# EasyEDA Pro project xiaozhi_pcb_v1.eprj

# Schematic Schematic1
Board Name: Watch; Create Date: 2025-01-26; Page Name: P1; Project Name: xiaozhi_pcb_v1; Schematic Name: Schematic1; Update Date: 2025-04-02; Company: myry; Drawed: myry; Page Size: A3; Reviewed: myry; Version: V1.0
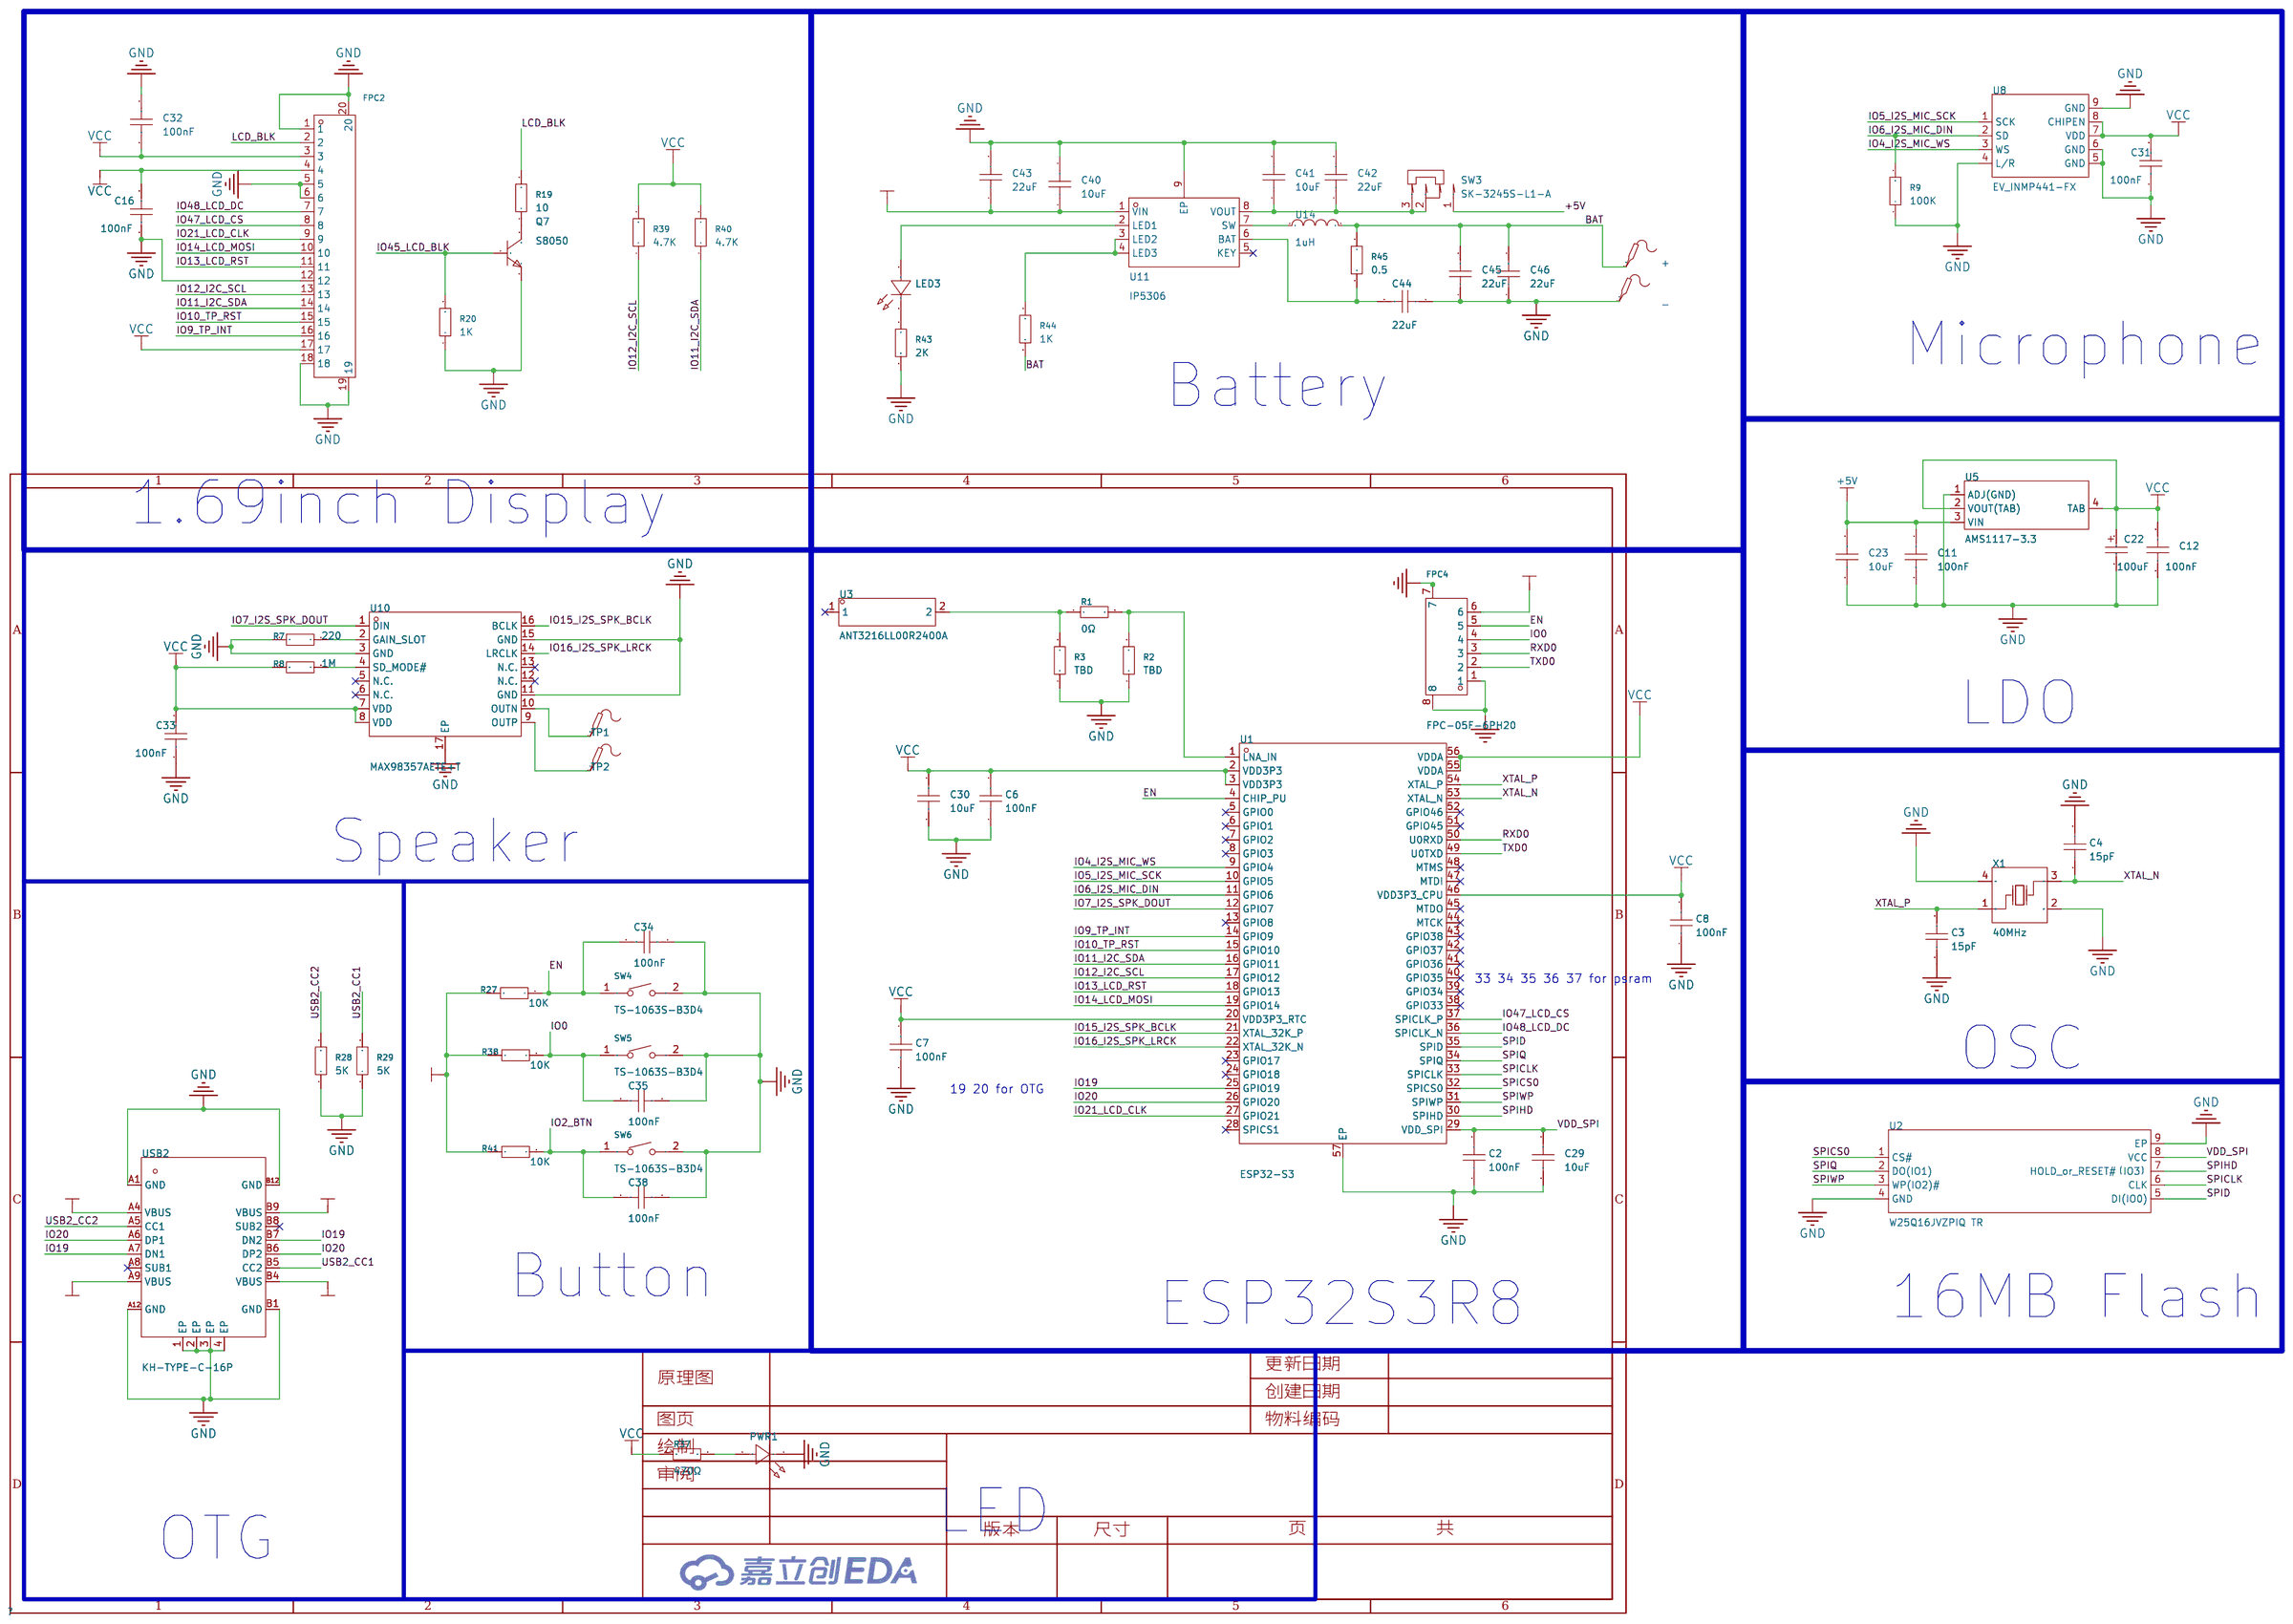
[diagram p0: schematic sheet]

## Parts
+  -  [Test-Point-0.5mm]
-  -  [Test-Point-0.5mm]
C2  100nF  [C0402]
C3  15pF  [C0402]
C4  15pF  [C0402]
C6  100nF  [C0402]
C7  100nF  [C0402]
C8  100nF  [C0402]
C11  100nF  [C0402]
C12  100nF  [C0402]
C16  100nF  [C0402]
C22  100uF  [CASE-B_3528]
C23  10uF  [C0603]
C29  10uF  [C0603]
C30  10uF  [C0603]
C31  100nF  [C0402]
C32  100nF  [C0402]
C33  100nF  [C0402]
C34  100nF  [C0402]
C35  100nF  [C0402]
C38  100nF  [C0402]
C40  10uF  [C0603]
C41  10uF  [C0603]
C42  22uF  [C0603]
C43  22uF  [C0603]
C44  22uF  [C0603]
C45  22uF  [C0603]
C46  22uF  [C0603]
FPC2  FPC-05F-18PH20  [FPC-SMD_18P-P0.50_FPC-05F-18PH20]
FPC4  FPC-05F-6PH20  [FPC-SMD_6P-P0.50_XUNPU_FPC-05F-6PH20]
LED3  XL-1608SURC-06  [LED0603-RD_RED]
PWR1  XL-1608SURC-06  [LED0603-RD_RED]
Q7  S8050  [SOT-23-3_L2.9-W1.3-P1.90-LS2.3-BR]
R1  0Ω  [R0402]
R2  TBD  [R0402]
R3  TBD  [R0402]
R7  220  [R0402]
R8  1M  [R0402]
R9  100K  [R0402]
R19  10  [R0402]
R20  1K  [R0402]
R27  10K  [R0402]
R28  5K  [R0402]
R29  5K  [R0402]
R37  470Ω  [R0402]
R38  10K  [R0402]
R39  4.7K  [R0402]
R40  4.7K  [R0402]
R41  10K  [R0402]
R43  2K  [R0402]
R44  1K  [R0402]
R45  0.5  [R0402]
SW3  SK-3245S-L1-A  [SW-SMD_SK-3245S-L1-A-1]
SW4  TS-1063S-B3D4  [KEY-SMD_L3.0-W2.5-LS4.0_TS-1603S]
SW5  TS-1063S-B3D4  [KEY-SMD_L3.0-W2.5-LS4.0_TS-1603S]
SW6  TS-1063S-B3D4  [KEY-SMD_L3.0-W2.5-LS4.0_TS-1603S]
TP1  -  [Test-Point-0.5mm]
TP2  -  [Test-Point-0.5mm]
U1  ESP32-S3  [QFN-56_L7.0-W7.0-P0.40-TL-EP4.0]
U2  W25Q16JVZPIQ TR  [WSON-8_L6.0-W5.0-P1.27-BL-EP]
U3  ANT3216LL00R2400A  [ANT-SMD_L3.2-W1.6]
U5  AMS1117-3.3  [SOT-223-4_L6.5-W3.5-P2.30-LS7.0-BR]
U8  EV_INMP441-FX  [MID-SMD_L4.7-W3.8_INMP441ACEZ]
U10  MAX98357AETE+T  [TQFN-16_L3.0-W3.0-P0.50-BL-EP1.5]
U11  IP5306  [ESOP-8_L4.9-W3.9-P1.27-LS6.0-BL-EP]
U14  1uH  [IND-SMD_L2.5-W2.0_YXNAQ252010-3R3M]
USB2  KH-TYPE-C-16P  [USB-C-SMD_KH-TYPE-C-16P]
X1  40MHz  [OSC-SMD_4P-L3.2-W2.5-BL_SIT8008BI]

## Library data of the parts
+ - TP1 TP2 = Test-Point: Test Point 测试点
C2-C4 C6-C8 = CL05A105KA5NQNC: Capacitance: Tolerance:±10% Tolerance:±10% Voltage Rated: Temperature Coefficient:; LCSC Part Name: 1uF ±10% 25V; Supplier Part: C52923; Manufacturer: SAMSUNG(三星); Supplier Footprint: 0402; JLCPCB Part Class: Basic Part; Datasheet: https://atta.szlcsc.com/upload/public/pdf/source/20160218/1457707763339.pdf; Supplier: LCSC; Tolerance: ±10%
C11 C12 C16 C31-C35 C38 = CL05B104KO5NNNC: Capacitance: Tolerance:±10% Tolerance:±10% Voltage Rated: Temperature Coefficient:; LCSC Part Name: 100nF ±10% 16V; Supplier Part: C1525; Manufacturer: SAMSUNG(三星); Supplier Footprint: 0402; JLCPCB Part Class: Basic Part; Datasheet: https://atta.szlcsc.com/upload/public/pdf/source/20160218/1457707763339.pdf; Supplier: LCSC; Tolerance: ±10%
C22 = TAJB107K006RNJ: Capacitance: Tolerance:±10% Tolerance:±10% Rated Voltage: Equivalent Series Resistance(ESR):1.7Ω@100kHz Operating Temperature:-55℃~+125℃ Operating Temperature:-55℃~+125℃; LCSC Part Name: 100uF ±10% 6.3V; Supplier Part: C16133; Manufacturer: Kyocera AVX; Supplier Footprint: CASE-B-3528-21(mm); JLCPCB Part Class: Basic Part; Datasheet: https://atta.szlcsc.com/upload/public/pdf/source/20160107/1457707750344.pdf; Supplier: LCSC; Tolerance: ±10%; Equivalent Series Resistance(ESR): 1.7Ω@100kHz; Operating Temperature: -55℃~+125℃
C23 C29 C30 C40-C46 = CGA0603X5R106K100JT: Capacitance:10uF Tolerance:±10% Tolerance:±10% Voltage Rating:10V Temperature Coefficient:X5R; LCSC Part Name: 10uF ±10% 10V; Supplier Part: C6119842; Manufacturer: HRE(芯声); Supplier Footprint: 0603; JLCPCB Part Class: Extended Part; Supplier: LCSC; Tolerance: ±10%; Voltage Rating: 10V; Temperature Coefficient: X5R
FPC2 = FPC-05F-18PH20: Locking Feature:Clamshell Contact Type:Bottom Contact Number of Contacts:18P Pitch:0.5mm Mounting Type:卧贴 FFC, FCB Thickness:0.3mm FFC, FCB Thickness:0.3mm Height Above Board:2mm Operating Temperature Range:-25℃~+85℃ Operating Temperature Range:-25℃~+85℃; LCSC Part Name: 间距:0.5mm P数:18P 翻盖式 下接; Supplier Part: C2856802; Manufacturer: XUNPU(讯普); Supplier Footprint: SMD,P=0.5mm,卧贴; JLCPCB Part Class: Extended Part; Datasheet: https://atta.szlcsc.com/upload/public/pdf/source/20210922/C2856802_2A845D1961F33AEC1ED22CECB292335F.pdf; Supplier: LCSC; Locking Feature: Clamshell; Contact Type: Bottom Contact; Number of Contacts: 18P; Pitch: 0.5mm; Mounting Type: 卧贴; FFC, FCB Thickness: 0.3mm; Height Above Board: 2mm; Operating Temperature Range: -25℃~+85℃
FPC4 = FPC-05F-6PH20: LCSC Part Name: 间距:0.5mm P数:6P 翻盖式 下接; Supplier Part: C2856796; Manufacturer: XUNPU(讯普); Supplier Footprint: SMD,P=0.5mm,卧贴; JLCPCB Part Class: Extended Part; Datasheet: https://atta.szlcsc.com/upload/public/pdf/source/20210922/16B003FB53336DDF6538142CC465AC4D.pdf; Supplier: LCSC; Locking Feature: Clamshell; Contact Type: Bottom Contact; Number of Contacts: 6P; Pitch: 0.5mm; Mounting Type: 卧贴; FFC, FCB Thickness: 0.3mm; Height Above Board: 2mm; Operating Temperature Range: -25℃~+85℃
LED3 PWR1 = XL-1608SURC-06: Emitted Color:Red Power Dissipation:55mW Forward Current:25mA Dominant Wavelength:617nm~621nm Dominant Wavelength:617nm~621nm Peak Wavelength:623nm Lens Color:无色透明透镜 Color Temperature:- Color Temperature:- Viewing Angle:120° Mounting Sytle:Positive post O; Supplier Part: C965799; Manufacturer: XINGLIGHT(成兴光); Supplier Footprint: 0603; JLCPCB Part Class: Extended Part; Datasheet: https://atta.szlcsc.com/upload/public/pdf/source/20221102/D860AFDD1CDB02C5A8064103A32707E2.pdf; Supplier: LCSC; Emitted Color: Red; Power Dissipation: 55mW; Forward Current: 25mA; Dominant Wavelength: 617nm~621nm; Peak Wavelength: 623nm; Lens Color: 无色透明透镜; Viewing Angle: 120°; Mounting Sytle: Positive post; Operating Temperature: -30℃~+85℃; Illumination Color: Red; Voltage - Forward(Vf): 2.3V; Power(Watts): 50mW; Wavelength - Dominant: 620nm~630nm; Luminous Intensity: 225mcd
Q7 = S8050_C20069125: type:NPN Current - Collector(Ic): Collector - Emitter Voltage VCEO: Pd - Power Dissipation:300mW DC Current Gain:120@50mA,1.0V DC Current Gain:120@50mA,1.0V Transition frequency(fT):100MHz Current - Collector Cutoff:100nA Vce Saturation(VCE(sat)):600mV Op; LCSC Part Name: hFE:200-350，丝印:J3Y S8050; Supplier Part: C20069125; Manufacturer: 宏嘉诚; Supplier Footprint: SOT-23; JLCPCB Part Class: Extended Part; Datasheet: https://atta.szlcsc.com/upload/public/pdf/source/20250107/343E8B94B5C24D0D65D7D4B70E0B73F6.pdf; Supplier: LCSC; type: NPN; Pd - Power Dissipation: 300mW; DC Current Gain: 120@50mA,1.0V; Transition frequency(fT): 100MHz; Current - Collector Cutoff: 100nA; Vce Saturation(VCE(sat)): 600mV; Operating Temperature: -55℃~+150℃
R1-R3 = 0402WGF0000TCE: Type:Thick Film Resistors Resistance: Tolerance:±1% Tolerance:±1% Power(Watts): Overload Voltage (Max): Temperature Coefficient:±800ppm/℃ Temperature Coefficient:±800ppm/℃ Operating Temperature Range:-55℃~+155℃ Operating Temperature Range:-55℃~+155℃; LCSC Part Name: 0Ω ±1% 62.5mW 厚膜电阻; Supplier Part: C17168; Manufacturer: UNI-ROYAL(厚声); Supplier Footprint: 0402; JLCPCB Part Class: Basic Part; Datasheet: https://atta.szlcsc.com/upload/public/pdf/source/20200306/C422600_1E6D84923E4A46A82E41ADD87F860B5C.pdf; Supplier: LCSC; Type: Thick Film Resistors; Tolerance: ±1%; Temperature Coefficient: ±800ppm/℃; Operating Temperature Range: -55℃~+155℃
R7-R9 R19 R20 R27-R29 R37-R41 R43-R45 = 0402WGF4700TCE: Type:Thick Film Resistors Resistance: Tolerance:±1% Tolerance:±1% Power(Watts): Overload Voltage (Max): Temperature Coefficient:±100ppm/℃ Temperature Coefficient:±100ppm/℃ Operating Temperature Range:-55℃~+155℃ Operating Temperature Range:-55℃~+155℃; LCSC Part Name: 470Ω ±1% 62.5mW 厚膜电阻; Supplier Part: C25117; Manufacturer: UNI-ROYAL(厚声); Supplier Footprint: 0402; JLCPCB Part Class: Basic Part; Datasheet: https://atta.szlcsc.com/upload/public/pdf/source/20200306/C422600_1E6D84923E4A46A82E41ADD87F860B5C.pdf; Supplier: LCSC; Type: Thick Film Resistors; Tolerance: ±1%; Temperature Coefficient: ±100ppm/℃; Operating Temperature Range: -55℃~+155℃
SW3 = SK-3245S-L1-A: Circuit:DPDT Actuator Style:Rectangular columnar Pin Style:SMDSplicing Switch Length:9.1mm Switch Width:3.55mm Switch Height:3.2mm Mounting Style:卧贴 Actuator Color:Black Current Rating (DC):50mA Voltage Rating (DC):12V Current Rating (AC):50mA Voltage Rat; LCSC Part Name: 柄长2mm 卧贴双档 滑动开关; Supplier Part: C405951; Manufacturer: XKB Connection(中国星坤); Supplier Footprint: SMD; JLCPCB Part Class: Extended Part; Datasheet: https://atta.szlcsc.com/upload/public/pdf/source/20200227/C405951_CBAB505F81ACCB08512C6DA919ADD92C.pdf; Supplier: LCSC; Circuit: DPDT; Actuator Style: Rectangular columnar; Pin Style: SMDSplicing; Switch Length: 9.1mm; Switch Width: 3.55mm; Switch Height: 3.2mm; Mounting Style: 卧贴; Actuator Color: Black; Current Rating (DC): 50mA; Voltage Rating (DC): 12V; Current Rating (AC): 50mA; Voltage Rating (AC): 12V; Mechanical Life: 1万次; Operating Temperature: -40℃~+85℃
SW4-SW6 = TS-1063S-B3D4: Circuit:SPST Actuator Style:Rectangle button Operating Force:250gf Mounting Style:- With Lamp:- Mechanical Life:-; LCSC Part Name: 轻触开关3.0*2.5侧按贴片带柱小小龟250gf; Supplier Part: C498291; Manufacturer: Yuandi(元迪); JLCPCB Part Class: Extended Part; Datasheet: https://atta.szlcsc.com/upload/public/pdf/source/20200318/C498291_A3607BD92317BA61A63F6AFAF35A0DD0.pdf; Supplier: LCSC; Circuit: SPST; Actuator Style: Rectangle button; Operating Force: 250gf
U1 = ESP32-S3: Frequency Range:2412MHz~2484MHz Frequency Range:2412MHz~2484MHz Interface:ADC,GPIO,I2C,I2S,PWM,SPI,UART,USB Operating Voltage:3V~3.6V Operating Voltage:3V~3.6V Applications:WiFi；IoT Output Power:21dBm Data Rate:150Mbps Current Of Transmitting:340mA Sensit; LCSC Part Name: 支持2.4GHz WIFI和低功耗蓝牙的MCU SoC; Supplier Part: C2913192; Manufacturer: ESPRESSIF(乐鑫); Supplier Footprint: QFN-56-EP(7x7); JLCPCB Part Class: Extended Part; Datasheet: https://atta.szlcsc.com/upload/public/pdf/source/20241030/3428D9BCA56E860957850BFAF37EAC62.pdf; Supplier: LCSC; Frequency Range: 2412MHz~2484MHz; Interface: ADC,GPIO,I2C,I2S,PWM,SPI,UART,USB; Operating Voltage: 3V~3.6V; Applications: WiFi；IoT; Output Power: 21dBm; Data Rate: 150Mbps; Current Of Transmitting: 340mA; Sensitivity: -98.4dBm; Receive Current: 88mA; Typical Application Frequency: 2.4GHz; Operating Temperature: -40℃~+105℃
U2 = W25Q16JVZPIQ TR: Supplier Part: C2456208; Manufacturer: WINBOND(华邦); Supplier Footprint: WSON-8-EP(5x6); JLCPCB Part Class: Extended Part; Datasheet: https://atta.szlcsc.com/upload/public/pdf/source/20190529/C115407_78E5B4F96E7138D299EC51EC5982A1A5.pdf; Supplier: LCSC
U3 = ANT3216LL00R2400A: Antenna Type:Chip Antenna Central Frequency:2450MHz Bandwidth:160MHz Peak Gain:5.05dBi Peak Gain:5.05dBi Polarization Type:Linear Impedance:50Ω Power capacity:1W VSWR:- Operating Temperature:-40℃~+105℃ Operating Temperature:-40℃~+105℃; LCSC Part Name: 无线组件陶瓷芯片天线; Supplier Part: C293767; Manufacturer: YAGEO(国巨); Supplier Footprint: 1206; JLCPCB Part Class: Extended Part; Datasheet: https://atta.szlcsc.com/upload/public/pdf/source/20181012/C293767_CDE82A2F74DC82A94DB708CB53B68F23.pdf; Supplier: LCSC; Antenna Type: Chip Antenna; Central Frequency: 2450MHz; Bandwidth: 160MHz; Peak Gain: 5.05dBi; Polarization Type: Linear; Impedance: 50Ω; Power capacity: 1W; Operating Temperature: -40℃~+105℃
U5 = AMS1117-3.3_C347222: Output Type:Fixed Voltage - Supply:12V Output Voltage:3.3V Output Voltage:3.3V Output Current:1A Power Supply Rejection Ratio (PSRR):60dB@(120Hz) Voltage Dropout:1.3V@(1A) standby current:- Noise:- Features:Overcurrent Protection Operating Temperature:- O; LCSC Part Name: 输出:3.3V 电流:1A 耐压:12V; Supplier Part: C347222; Manufacturer: UMW(友台半导体); Supplier Footprint: SOT-223; JLCPCB Part Class: Extended Part; Datasheet: https://atta.szlcsc.com/upload/public/pdf/source/20241218/BAF0263FA2E44BCD8AF41AA4FA04EFAA.pdf; Supplier: LCSC; Output Type: Fixed; Voltage - Supply: 12V; Output Voltage: 3.3V; Output Current: 1A; Power Supply Rejection Ratio (PSRR): 60dB@(120Hz); Voltage Dropout: 1.3V@(1A); Features: Overcurrent Protection; Output Configuration: Positive electrode; Number of Outputs: 1
U8 = EV_INMP441-FX: Sensor Type:Audio; Supplier Part: C17499176; Manufacturer: TDK InvenSense(应美盛); JLCPCB Part Class: Extended Part; Supplier: LCSC; Sensor Type: Audio
U10 = MAX98357AETE+T: Type of Power Amplifier: Speaker Channels:Monaural Output Power: Supply Voltage:2.5V~5.5V Supply Voltage:2.5V~5.5V Operating Temperature:-40℃~+85℃ Operating Temperature:-40℃~+85℃; LCSC Part Name: 微型、低成本、PCM 类 D 级放大器具有 AB 级性能; Supplier Part: C910544; Manufacturer: ADI(亚德诺)/MAXIM(美信); Supplier Footprint: TQFN-16-EP(3x3); JLCPCB Part Class: Extended Part; Datasheet: https://atta.szlcsc.com/upload/public/pdf/source/20210106/C910544_CB6DE4B2CEE254A72E6BDB40E718D281.pdf; Supplier: LCSC; Speaker Channels: Monaural; Supply Voltage: 2.5V~5.5V; Operating Temperature: -40℃~+85℃
U11 = IP5306: Supplier Part: C181692; Manufacturer: INJOINIC(英集芯); Supplier Footprint: ESOP-8; JLCPCB Part Class: Extended Part; Datasheet: https://atta.szlcsc.com/upload/public/pdf/source/20190627/C384572_9925B3DDC4041BC6108E5AB46A2A0AB1.pdf; Supplier: LCSC
U14 = IND\L2.5XW: Supplier Part: C9900016568; Supplier Footprint: 2.2uH/60; JLCPCB Part Class: Extended Part; Supplier: LCSC
USB2 = KH-TYPE-C-16P: Connector Type:Type-C Standard:- Gender:Female Number of Ports:1 Number of Contacts:16P Mounting Style:卧贴 Current Rating - Power (Max):3A Operating Temperature Range:-40℃~+85℃ Operating Temperature Range:-40℃~+85℃; LCSC Part Name: Type-C 母 卧贴; Supplier Part: C709357; Manufacturer: kinghelm(金航标); Supplier Footprint: SMD; JLCPCB Part Class: Extended Part; Datasheet: https://atta.szlcsc.com/upload/public/pdf/source/20200911/C709357_AA8DCEB38BB20E3035A7ED7AE7667837.pdf; Supplier: LCSC; Connector Type: Type-C; Gender: Female; Number of Ports: 1; Number of Contacts: 16P; Mounting Style: 卧贴; Current Rating - Power (Max): 3A; Operating Temperature Range: -40℃~+85℃
X1 = X322540MPB4SI: Crystal Type:Surface Mount Crystal Frequency: Normal temperature Frequency Tolerance:±10ppm Normal temperature Frequency Tolerance:±10ppm External load capacitor: Frequency Stability(Full temperature range):±20ppm Frequency Stability(Full temperature rang; LCSC Part Name: 40MHz ±10ppm 15pF; Supplier Part: C9010; Manufacturer: YXC(扬兴晶振); Supplier Footprint: SMD3225-4P; JLCPCB Part Class: Extended Part; Datasheet: https://atta.szlcsc.com/upload/public/pdf/source/20240329/19D5F850207469550BEB00D7DFEDBC7A.pdf; Supplier: LCSC; Crystal Type: Surface Mount Crystal; Normal temperature Frequency Tolerance: ±10ppm; Frequency Stability(Full temperature range): ±20ppm

## Nets
3V3: R27.2 R38.2 R41.2
+5V: C11.1 C23.2 SW3.1 U5.3(VIN)
GND: -.1 C2.1 C3.1 C4.2 C6.1 C7.1 C8.1 C11.2 C12.2 C16.1 C22.2 C23.1 C29.1 C30.1 C31.1 C32.1 C33.1 C34.1 C35.1 C38.1 C40.2 C41.2 C42.2 C43.2 C44.1 C45.1 C46.1 FPC2.1 FPC2.5 FPC2.6 FPC2.12 FPC2.18 FPC2.19 FPC2.20 FPC4.1 FPC4.7 PWR1.1(K) Q7.2(E) R2.1 R3.1 R7.2 R9.1 R20.1 R28.1 R29.1 R43.2 SW4.2 SW5.2 SW6.2 U1.57(EP) U2.4(GND) U2.9(EP) U5.1(ADJ(GND)) U8.4(L/R) U8.5(GND) U8.6(GND) U8.9(GND) U10.3(GND) U10.11(GND) U10.15(GND) U10.17(EP) U11.9(EP) USB2.1(EP) USB2.2(EP) USB2.3(EP) USB2.4(EP) USB2.A1(GND) USB2.A12(GND) USB2.B1(GND) USB2.B12(GND) X1.2(GND) X1.4(GND)
VCC: C6.2 C7.2 C8.2 C12.1 C16.2 C22.1 C30.2 C31.2 C32.2 C33.2 FPC2.3 FPC2.4 FPC2.17 R8.2 R37.2 R39.2 R40.2 U1.2(VDD3P3) U1.3(VDD3P3) U1.20(VDD3P3_RTC) U1.46(VDD3P3_CPU) U1.55(VDDA) U1.56(VDDA) U5.2(VOUT(TAB)) U5.4(TAB) U8.7(VDD) U8.8(CHIPEN) U10.7(VDD) U10.8(VDD)
VDD_SPI: C2.2 C29.2 U1.29(VDD_SPI) U2.8(VCC)
BAT: +.1 C45.2 C46.2 R44.2 R45.1 U14.2
EN: C34.2 FPC4.5 R27.1 SW4.1 U1.4(CHIP_PU)
IO0: C35.2 FPC4.4 R38.1 SW5.1
IO2_BTN: C38.2 R41.1 SW6.1
IO4_I2S_MIC_WS: U1.9(GPIO4) U8.3(WS)
IO5_I2S_MIC_SCK: U1.10(GPIO5) U8.1(SCK)
IO6_I2S_MIC_DIN: R9.2 U1.11(GPIO6) U8.2(SD)
IO7_I2S_SPK_DOUT: U1.12(GPIO7) U10.1(DIN)
IO9_TP_INT: FPC2.16 U1.14(GPIO9)
IO10_TP_RST: FPC2.15 U1.15(GPIO10)
IO11_I2C_SDA: FPC2.14 R40.1 U1.16(GPIO11)
IO12_I2C_SCL: FPC2.13 R39.1 U1.17(GPIO12)
IO13_LCD_RST: FPC2.11 U1.18(GPIO13)
IO14_LCD_MOSI: FPC2.10 U1.19(GPIO14)
IO15_I2S_SPK_BCLK: U1.21(XTAL_32K_P) U10.16(BCLK)
IO16_I2S_SPK_LRCK: U1.22(XTAL_32K_N) U10.14(LRCLK)
IO19: U1.25(GPIO19) USB2.A7(DN1) USB2.B7(DN2)
IO20: U1.26(GPIO20) USB2.A6(DP1) USB2.B6(DP2)
IO21_LCD_CLK: FPC2.9 U1.27(GPIO21)
IO45_LCD_BLK: Q7.1(B) R20.2
IO47_LCD_CS: FPC2.8 U1.37(SPICLK_P)
IO48_LCD_DC: FPC2.7 U1.36(SPICLK_N)
LCD_BLK: FPC2.2 R19.2
RXD0: FPC4.3 U1.50(U0RXD)
SPICLK: U1.33(SPICLK) U2.6(CLK)
SPICS0: U1.32(SPICS0) U2.1(CS#)
SPID: U1.35(SPID) U2.5(DI(IO0))
SPIHD: U1.30(SPIHD) U2.7(HOLD or RESET#（IO3）)
SPIQ: U1.34(SPIQ) U2.2(DO(IO1))
SPIWP: U1.31(SPIWP) U2.3(WP(IO2)#)
TXD0: FPC4.2 U1.49(U0TXD)
USB2_CC1: R29.2 USB2.B5(CC2)
USB2_CC2: R28.2 USB2.A5(CC1)
USB_5V: C40.1 C43.1 FPC4.6 U11.1(VIN) USB2.A4(VBUS) USB2.A9(VBUS) USB2.B4(VBUS) USB2.B9(VBUS)
XTAL_N: C4.1 U1.53(XTAL_N) X1.3(OSC2)
XTAL_P: C3.2 U1.54(XTAL_P) X1.1(OSC1)
$1N26054: R1.2 R2.2 U1.1(LNA_IN)
$1N26055: R1.1 R3.2 U3.2
$1N27034: PWR1.2(A) R37.1
$1N27718: Q7.3(C) R19.1
$1N28035: R7.1 U10.2(GAIN_SLOT)
$1N28037: R8.1 U10.4(SD_MODE#)
$1N28041: TP1.1 U10.10(OUTN)
$1N28042: TP2.1 U10.9(OUTP)
$1N28915: LED3.2(A) U11.2(LED1)
$1N28918: R44.1 U11.3(LED2) U11.4(LED3)
$1N28921: C41.1 C42.1 SW3.2 SW3.3 U11.8(VOUT)
$1N28924: U11.7(SW) U14.1
$1N28927: C44.2 R45.2 U11.6(BAT)
$1N30162: LED3.1(K) R43.1

Not connected (* = marked no-connect by the designer): FPC4 8; U1 5(GPIO0)* 6(GPIO1)* 7(GPIO2)* 8(GPIO3)* 13(GPIO8)* 23(GPIO17)* 24(GPIO18)* 28(SPICS1)* 38(GPIO33)* 39(GPIO34)* 40(GPIO35)* 41(GPIO36)* 42(GPIO37)* 43(GPIO38)* 44(MTCK)* 45(MTDO)* 47(MTDI)* 48(MTMS)* 51(GPIO45)* 52(GPIO46)*; U3 1*; U10 5(N.C.)* 6(N.C.)* 12(N.C.)* 13(N.C.)*; U11 5(KEY)*; USB2 A8(SUB1)* B8(SUB2)*

## Notes on the sheet
- Microphone
- Battery
- 1.69inch Display
- LDO
- Speaker
- 33 34 35 36 37 for psram
- OSC
- 19 20 for OTG
- Button
- 16MB Flash
- ESP32S3R8
- LED
- OTG

# Schematic Schematic2
Board Name: CH340C; Create Date: 2025-01-26; Page Name: P1; Project Name: watch_src; Schematic Name: Schematic2; Update Date: 2025-01-26; Company: myry; Drawed: myry; Page Size: A3; Reviewed: myry; Version: V1.0
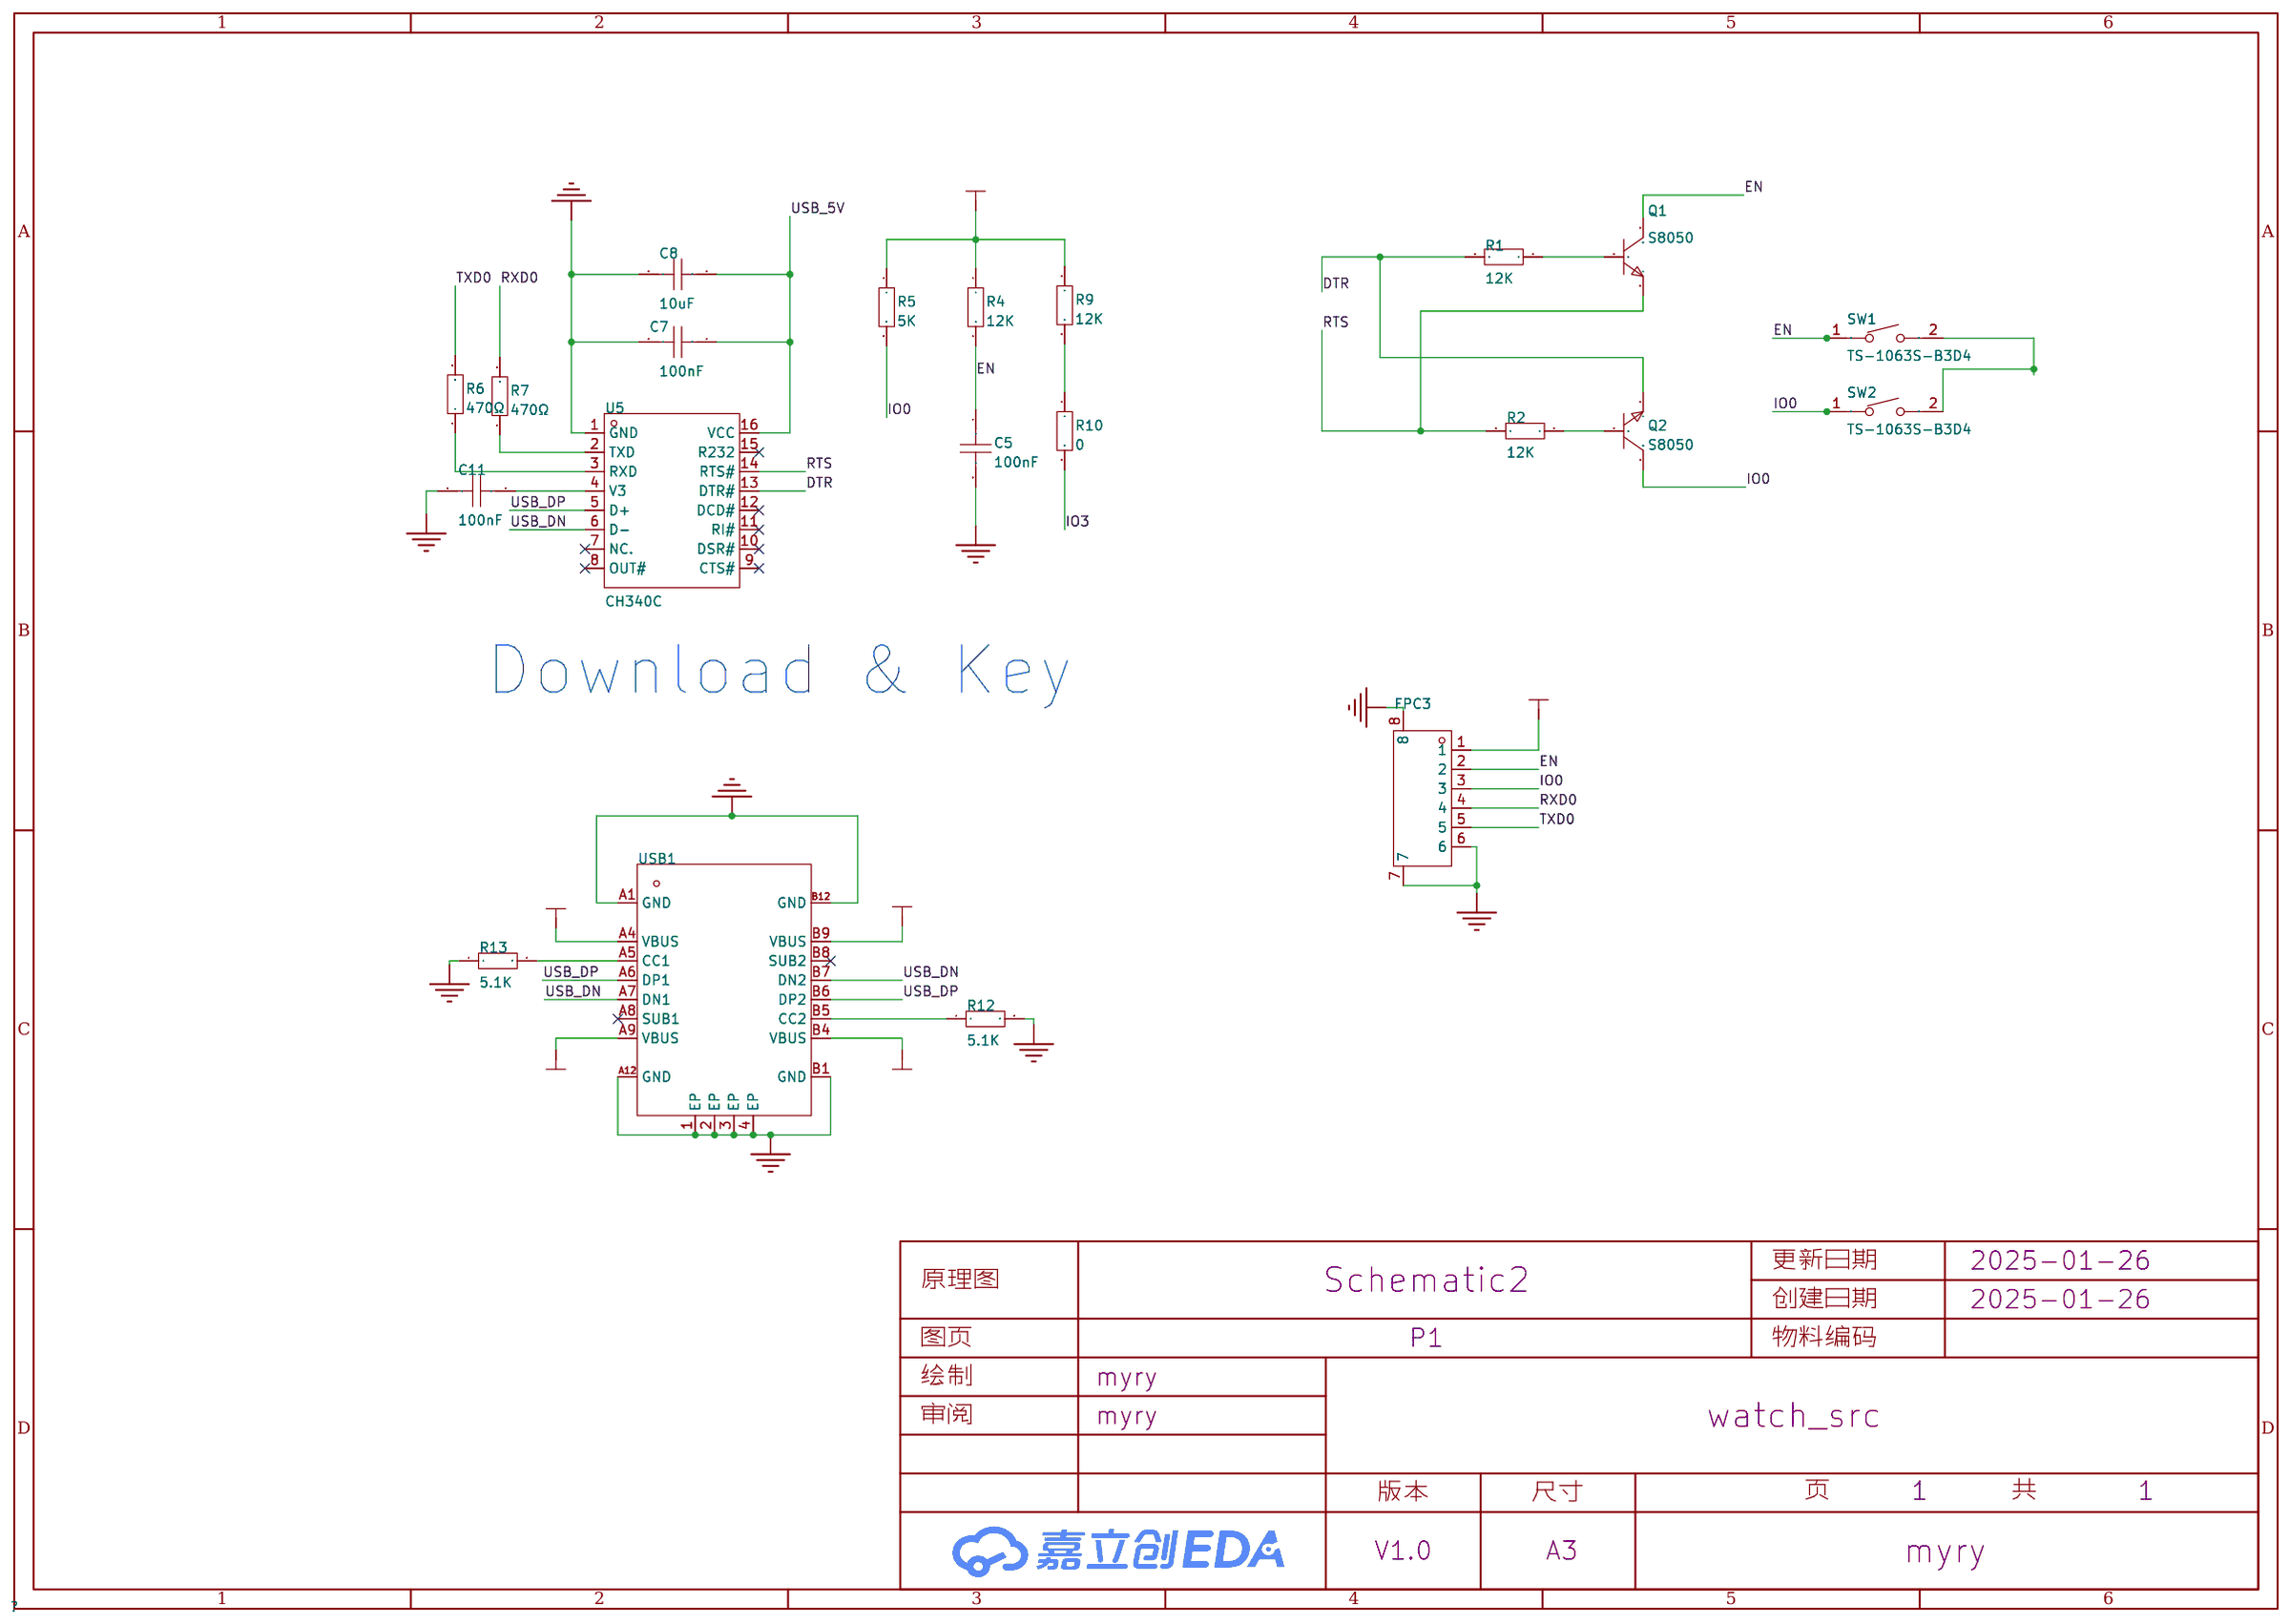
[diagram p1: schematic sheet]

## Parts
C5  100nF  [C0402]
C7  100nF  [C0402]
C8  10uF  [C0603]
C11  100nF  [C0402]
FPC3  FPC-05F-6PH20  [FPC-SMD_6P-P0.50_XUNPU_FPC-05F-6PH20]
Q1  S8050  [SOT-23-3_L2.9-W1.3-P1.90-LS2.3-BR]
Q2  S8050  [SOT-23-3_L2.9-W1.3-P1.90-LS2.3-BR]
R1  12K  [R0402]
R2  12K  [R0402]
R4  12K  [R0402]
R5  5K  [R0402]
R6  470Ω  [R0402]
R7  470Ω  [R0402]
R9  12K  [R0402]
R10  0  [R0402]
R12  5.1K  [R0402]
R13  5.1K  [R0402]
SW1  TS-1063S-B3D4  [KEY-SMD_L3.0-W2.5-LS4.0_TS-1603S]
SW2  TS-1063S-B3D4  [KEY-SMD_L3.0-W2.5-LS4.0_TS-1603S]
U5  CH340C  [SOP-16_L10.0-W3.9-P1.27-LS6.0-BL]
USB1  KH-TYPE-C-16P  [USB-C-SMD_KH-TYPE-C-16P]

## Library data of the parts
C5 C7 C11 = CL05B104KO5NNNC: 容值:100nF;精度:±10%;额定电压:16V;材质(温度系数):X7R;; LCSC Part Name: 100nF ±10% 16V; Supplier Part: C1525; Manufacturer: SAMSUNG(三星); Supplier Footprint: 0402; Datasheet: https://atta.szlcsc.com/upload/public/pdf/source/20160218/1457707763339.pdf; Supplier: LCSC; Tolerance: ±10%; Voltage Rated: 16V; Temperature Coefficient: X7R
C8 = CGA0603X5R106K100JT: 容值:10uF;精度:±10%;额定电压:10V;材质(温度系数):X5R;; LCSC Part Name: 10uF ±10% 10V; Supplier Part: C6119842; Manufacturer: HRE(芯声); Supplier Footprint: 0603; JLCPCB Part Class: 扩展库; Supplier: LCSC; Tolerance: ±10%; Voltage Rated: 10V; Temperature Coefficient: X5R
FPC3 = FPC-05F-6PH20: LCSC Part Name: 间距:0.5mm P数:6P 翻盖式 下接; Supplier Part: C2856796; Manufacturer: XUNPU(讯普); Supplier Footprint: SMD,P=0.5mm,卧贴; JLCPCB Part Class: 扩展库; Datasheet: https://atta.szlcsc.com/upload/public/pdf/source/20210922/16B003FB53336DDF6538142CC465AC4D.pdf; Supplier: LCSC; Locking Feature: 翻盖式; Contact Type: 下接; Number of Contacts: 6P; Pitch: 0.5mm; Mounting Type: 卧贴; FFC, FCB Thickness: 0.3mm; Height Above Board: 2mm; Operating Temperature Range: -25℃~+85℃
Q1 Q2 = S8050_C20069125: 晶体管类型:NPN;集电极电流(Ic):500mA;集射极击穿电压(Vceo):25V;功率(Pd):300mW;直流电流增益(hFE@Ic,Vce):120@50mA,1.0V;; LCSC Part Name: hFE:200-350，丝印:J3Y; Supplier Part: C20069125; Manufacturer: 宏迦橙; Supplier Footprint: SOT-23; JLCPCB Part Class: 扩展库; Datasheet: https://atta.szlcsc.com/upload/public/pdf/source/20240403/2D78449C96B6E27F13BF8BDF79E27159.pdf; Supplier: LCSC; Transistor Type: NPN; Collector Current (Ic): 500mA; Collector-Emitter Breakdown Voltage (Vceo): 25V; Power Dissipation (Pd): 300mW; DC Current Gain (hFE@Ic,Vce): 120@50mA,1.0V; Transition Frequency (fT): 100MHz; Collector Cut-Off Current (Icbo): 100nA; Collector-Emitter Saturation Voltage (VCE(sat)@Ic,Ib): 600mV@500mA,50mA; Operating Temperature: -55℃~+150℃
R1 R2 R4-R7 R9 R10 R12 R13 = 0402WGF4700TCE: 电阻类型:厚膜电阻;阻值:470Ω;精度:±1%;功率:62.5mW;最大工作电压:50V;温度系数:±100ppm/℃;; LCSC Part Name: 470Ω ±1% 62.5mW 厚膜电阻; Supplier Part: C25117; Manufacturer: UNI-ROYAL(厚声); Supplier Footprint: 0402; JLCPCB Part Class: 基础库; Datasheet: https://atta.szlcsc.com/upload/public/pdf/source/20200306/C422600_1E6D84923E4A46A82E41ADD87F860B5C.pdf; Supplier: LCSC; Type: 厚膜电阻; Tolerance: ±1%; Power(Watts): 62.5mW; Overload Voltage (Max): 50V; Temperature Coefficient: ±100ppm/℃; Operating Temperature Range: -55℃~+155℃
SW1 SW2 = TS-1063S-B3D4: LCSC Part Name: 轻触开关3.0*2.5侧按贴片带柱小小龟250gf; Supplier Part: C498291; Manufacturer: Yuandi(元迪); JLCPCB Part Class: 扩展库; Datasheet: https://atta.szlcsc.com/upload/public/pdf/source/20200318/C498291_A3607BD92317BA61A63F6AFAF35A0DD0.pdf; Supplier: LCSC; Circuit: 单刀单掷; Actuator Style: 矩形按钮; Operating Force: 250gf
U5 = CH340C: 应用功能:收发器;接口协议:USB 2.0;数据速率:2Mbps;; LCSC Part Name: CH340C USB转串口芯片 CH340; Supplier Part: C84681; Manufacturer: WCH(南京沁恒); Supplier Footprint: SOP-16; Datasheet: https://atta.szlcsc.com/upload/public/pdf/source/20240619/63986D8440D4E5267A77ACD891CC4DE3.pdf; Supplier: LCSC; Applications Function: 收发器; Protocol: USB 2.0; Supply Voltage: 3.3V；5V; Data Rate: 2Mbps
USB1 = KH-TYPE-C-16P: 连接器类型:Type-C;标准:-;公母:母;端口数量:1;触点数量:16P;安装方式:卧贴;额定电流 - 电源:3A;工作温度范围:-40℃~+85℃;; LCSC Part Name: Type-C 母 卧贴; Supplier Part: C709357; Manufacturer: kinghelm(金航标); Supplier Footprint: SMD; Datasheet: https://atta.szlcsc.com/upload/public/pdf/source/20200911/C709357_AA8DCEB38BB20E3035A7ED7AE7667837.pdf; Supplier: LCSC; Connector Type: Type-C; Gender: 母; Number of Ports: 1; Number of Contacts: 16P; Mounting Style: 卧贴; Current Rating - Power (Max): 3A; Operating Temperature Range: -40℃~+85℃

## Nets
3V3: R4.1 R5.1 R9.1
5V: FPC3.1
GND: C5.2 C7.2 C8.2 C11.2 FPC3.6 FPC3.7 FPC3.8 R12.2 R13.1 U5.1(GND) USB1.1(EP) USB1.2(EP) USB1.3(EP) USB1.4(EP) USB1.A1(GND) USB1.A12(GND) USB1.B1(GND) USB1.B12(GND)
DTR: Q2.2(E) R1.2 U5.13(DTR#)
EN: C5.1 FPC3.2 Q1.3(C) R4.2 SW1.1
IO0: FPC3.3 Q2.3(C) R5.2 SW2.1
IO3: R10.2
RTS: Q1.2(E) R2.2 U5.14(RTS#)
RXD0: FPC3.4 R7.2
TXD0: FPC3.5 R6.2
USB_5V: C7.1 C8.1 U5.16(VCC) USB1.A4(VBUS) USB1.A9(VBUS) USB1.B4(VBUS) USB1.B9(VBUS)
USB_DN: U5.6(D-) USB1.A7(DN1) USB1.B7(DN2)
USB_DP: U5.5(D+) USB1.A6(DP1) USB1.B6(DP2)
$1N1062: R7.1 U5.2(TXD)
$1N1063: R6.1 U5.3(RXD)
$1N1064: C11.1 U5.4(V3)
$1N1079: R12.1 USB1.B5(CC2)
$1N1081: R13.2 USB1.A5(CC1)
$1N1094: Q1.1(B) R1.1
$1N1097: Q2.1(B) R2.1
$1N1108: R9.2 R10.1
$1N1115: SW1.2 SW2.2

Not connected (* = marked no-connect by the designer): U5 7(NC.)* 8(OUT#)* 9(CTS#)* 10(DSR#)* 11(RI#)* 12(DCD#)* 15(R232)*; USB1 A8(SUB1)* B8(SUB2)*

## Notes on the sheet
- Download & Key

# Board PCB1
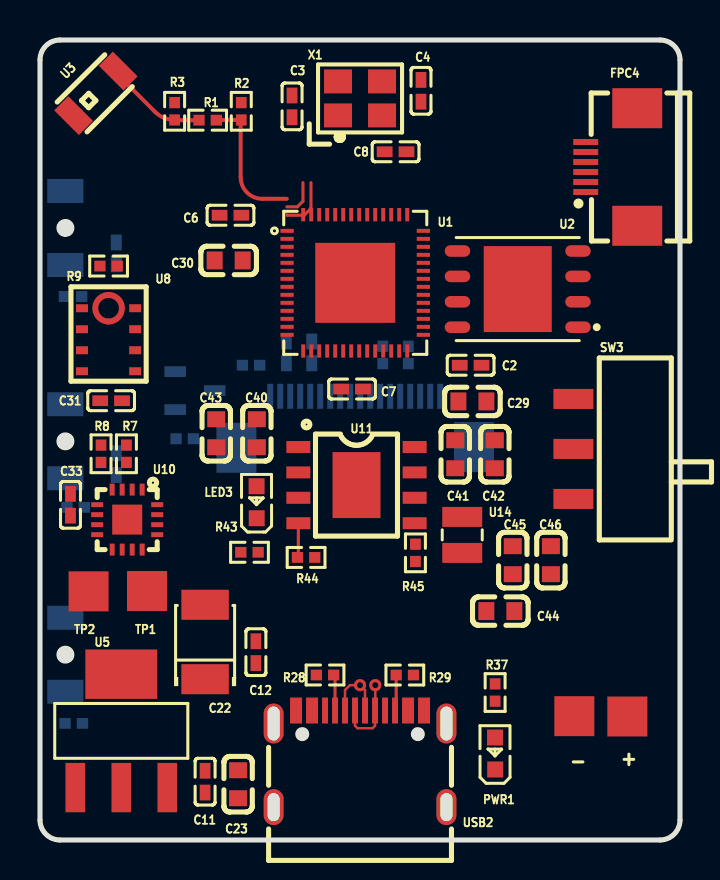
[diagram p2: board, top side]
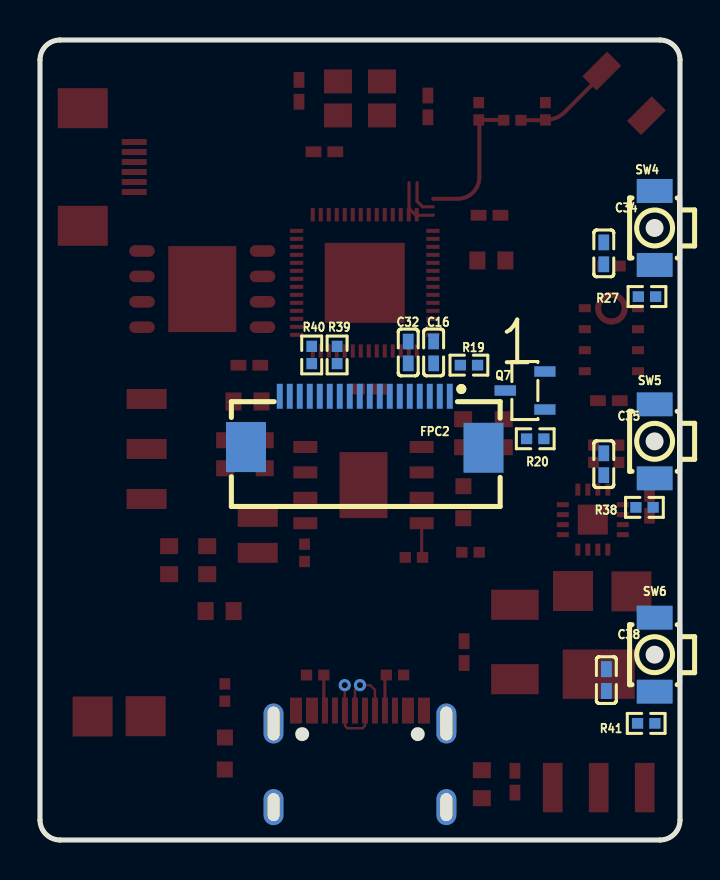
[diagram p3: board, bottom side, seen from below]

Outline 32 x 40 mm; copper layers: Top Layer, Bottom Layer. Coordinates in mm from the lower left corner of the outline.
Outline path: 0,39 0,1 arc(0.29,0.29) 1,0 31,0 arc(31.71,0.29) 32,1 32,39 arc(31.71,39.71) 31,40 1,40 arc(0.29,39.71) 0,39
Stack: Top Layer 0.035mm / Dielectric1 1.51mm FR4 er 4.5 / Bottom Layer 0.035mm

## Design rules (mm)
net IO19: DP1
net IO20: DP1
template: Custom Config
spacing copperThickness1oz (default): track to track 0.102, other pairs 0.152 to 0.3
spacing copperThickness2oz: track to track 0.203, other pairs 0.152 to 0.3
track width copperThickness1oz (default): min 0.127, default 0.157, max 2.54
track width copperThickness2oz: min 0.203, default 0.254, max 2.54
differential pair differentialPair (default): width min 0.124, default 0.124, max 2.54; gap min 0.203, default 0.203
via viaSize (default): diameter min 0.5, default 0.61, max 10; hole min 0.3, default 0.305, max 6.3

## Placement (name value [footprint] x y rotation side)
+  -  [Test-Point-0.5mm]  29.37 6.17 0 top
-  -  [Test-Point-0.5mm]  26.72 6.19 0 top
C2  100nF  [C0402]  21.53 23.74 180 top
C3  15pF  [C0402]  12.6 36.68 270 top
C4  15pF  [C0402]  19.05 37.46 270 top
C6  100nF  [C0402]  9.53 31.24 0 top
C7  100nF  [C0402]  15.6 22.55 180 top
C8  100nF  [C0402]  17.78 34.41 180 top
C11  100nF  [C0402]  8.25 2.92 270 top
C12  100nF  [C0402]  10.8 9.39 90 top
C16  100nF  [C0402]  12.32 24.38 270 bottom
C22  100uF  [CASE-B_3528]  8.25 9.9 90 top
C23  10uF  [C0603]  9.91 2.79 90 top
C29  10uF  [C0603]  21.62 21.93 180 top
C30  10uF  [C0603]  9.43 28.98 0 top
C31  100nF  [C0402]  3.56 21.97 180 top
C32  100nF  [C0402]  13.59 24.38 270 bottom
C33  100nF  [C0402]  1.52 16.76 270 top
C34  100nF  [C0402]  3.81 29.33 270 bottom
C35  100nF  [C0402]  3.81 18.79 270 bottom
C38  100nF  [C0402]  3.68 8 270 bottom
C40  10uF  [C0603]  10.84 20.34 90 top
C41  10uF  [C0603]  20.76 19.29 270 top
C42  22uF  [C0603]  22.74 19.29 270 top
C43  22uF  [C0603]  8.81 20.34 90 top
C44  22uF  [C0603]  23.02 11.45 180 top
C45  22uF  [C0603]  23.64 13.99 90 top
C46  22uF  [C0603]  25.54 13.99 90 top
FPC2  FPC-05F-18PH20  [FPC-SMD_18P-P0.50_FPC-05F-18PH20]  15.76 20.9 180 bottom
FPC4  FPC-05F-6PH20  [FPC-SMD_6P-P0.50_XUNPU_FPC-05F-6PH20]  28.58 33.65 90 top
LED3  XL-1608SURC-06  [LED0603-RD_RED]  10.83 16.89 90 top
PWR1  XL-1608SURC-06  [LED0603-RD_RED]  22.76 4.33 90 top
Q7  S8050  [SOT-23-3_L2.9-W1.3-P1.90-LS2.3-BR]  7.75 22.47 180 bottom
R1  0Ω  [R0402]  8.38 35.99 0 top
R2  TBD  [R0402]  10.06 36.44 270 top
R3  TBD  [R0402]  6.73 36.44 270 top
R7  220  [R0402]  4.32 19.31 90 top
R8  1M  [R0402]  3.05 19.31 90 top
R9  100K  [R0402]  3.43 28.7 0 top
R19  10  [R0402]  10.55 23.74 0 bottom
R20  1K  [R0402]  7.24 20.06 180 bottom
R27  10K  [R0402]  1.65 27.17 0 bottom
R28  5K  [R0402]  14.25 8.25 0 top
R29  5K  [R0402]  18.24 8.25 180 top
R37  470Ω  [R0402]  22.76 7.37 90 top
R38  10K  [R0402]  1.78 16.63 0 bottom
R39  4.7K  [R0402]  17.15 24.25 90 bottom
R40  4.7K  [R0402]  18.42 24.25 90 bottom
R41  10K  [R0402]  1.69 5.83 0 bottom
R43  2K  [R0402]  10.47 14.39 180 top
R44  1K  [R0402]  13.31 14.13 0 top
R45  0.5  [R0402]  18.77 14.36 90 top
SW3  SK-3245S-L1-A  [SW-SMD_SK-3245S-L1-A-1]  26.67 19.55 270 top
SW4  TS-1063S-B3D4  [KEY-SMD_L3.0-W2.5-LS4.0_TS-1603S]  1.27 30.6 90 bottom
SW5  TS-1063S-B3D4  [KEY-SMD_L3.0-W2.5-LS4.0_TS-1603S]  1.27 19.93 90 bottom
SW6  TS-1063S-B3D4  [KEY-SMD_L3.0-W2.5-LS4.0_TS-1603S]  1.27 9.27 90 bottom
TP1  -  [Test-Point-0.5mm]  5.35 12.45 180 top
TP2  -  [Test-Point-0.5mm]  2.43 12.43 180 top
U1  ESP32-S3  [QFN-56_L7.0-W7.0-P0.40-TL-EP4.0]  15.76 27.86 0 top
U2  W25Q16JVZPIQ TR  [WSON-8_L6.0-W5.0-P1.27-BL-EP]  23.89 27.55 90 top
U3  ANT3216LL00R2400A  [ANT-SMD_L3.2-W1.6]  2.79 37.33 45 top
U5  AMS1117-3.3  [SOT-223-4_L6.5-W3.5-P2.30-LS7.0-BR]  4.06 5.46 270 top
U8  EV_INMP441-FX  [MID-SMD_L4.7-W3.8_INMP441ACEZ]  3.43 25.01 90 top
U10  MAX98357AETE+T  [TQFN-16_L3.0-W3.0-P0.50-BL-EP1.5]  4.36 16.02 180 top
U11  IP5306  [ESOP-8_L4.9-W3.9-P1.27-LS6.0-BL-EP]  15.83 17.74 270 top
U14  1uH  [IND-SMD_L2.5-W2.0_YXNAQ252010-3R3M]  21.11 15.26 90 top
USB2  KH-TYPE-C-16P  [USB-C-SMD_KH-TYPE-C-16P]  16 4.06 0 top
X1  40MHz  [OSC-SMD_4P-L3.2-W2.5-BL_SIT8008BI]  16 37.08 0 top

## Footprints (pads in the part's own frame, mm; a bottom-side part is the same pattern mirrored in y, then rotated)
ANT-SMD_L3.2-W1.6
  rect 1x1.75 smd: 1(-1.578,0) 2(1.578,0)
C0402
  rect 0.79x0.54 smd: 1(-0.545,0) 2(0.545,0)
C0603
  rect 0.8x0.9 smd: 1(-0.7,0) 2(0.7,0)
CASE-B_3528
  rect 1.506x2.376 smd: 1(-1.861,0) 2(1.861,0)
ESOP-8_L4.9-W3.9-P1.27-LS6.0-BL-EP
  rect 0.6x1.2 smd: 1(-1.905,-2.909) 2(-0.635,-2.909) 3(0.635,-2.909) 4(1.905,-2.909) 5(1.905,2.909) 6(0.635,2.909) 7(-0.635,2.909) 8(-1.905,2.909)
  rect 3.3x2.4 smd: 9(0,0)
FPC-SMD_6P-P0.50_XUNPU_FPC-05F-6PH20
  rect 0.3x1.25 smd: 1(-1.25,1.288) 2(-0.75,1.288) 3(-0.25,1.288) 4(0.25,1.288) 5(0.75,1.288) 6(1.25,1.288)
  rect 2x2.5 smd: 7(2.94,-1.288) 8(-2.94,-1.288)
FPC-SMD_18P-P0.50_FPC-05F-18PH20
  rect 0.3x1.25 smd: 1(4.25,1.288) 2(3.75,1.288) 3(3.25,1.288) 4(2.75,1.288) 5(2.25,1.288) 6(1.75,1.288) 7(1.25,1.288) 8(0.75,1.288) 9(0.25,1.288) 10(-0.25,1.288) 11(-0.75,1.288) 12(-1.25,1.288) 13(-1.75,1.288) 14(-2.25,1.288) 15(-2.75,1.288) 16(-3.25,1.288) 17(-3.75,1.288) 18(-4.25,1.288)
  rect 2x2.5 smd: 19(5.94,-1.288) 20(-5.94,-1.252)
IND-SMD_L2.5-W2.0_YXNAQ252010-3R3M
  rect 1x2 smd: 1(0.9,0) 2(-0.9,0)
KEY-SMD_L3.0-W2.5-LS4.0_TS-1603S
  rect 1.2x1.8 smd: 1(-1.85,0) 2(1.85,0)
LED0603-RD_RED
  rect 0.8x0.8 smd: 1(-0.799,-0.004) 2(0.799,0.004)
MID-SMD_L4.7-W3.8_INMP441ACEZ
  rect 0.4x0.6 smd: 1(-1.575,-1.33) 2(-0.525,-1.33) 3(0.525,-1.33) 4(1.575,-1.33) 6(1.575,1.33) 7(0.525,1.33) 8(-0.525,1.33) 9(-1.575,1.33)
  custom 1.626x0.963 smd: 5(1.575,0.664)
  custom 1.626x0.966 smd: 5(1.575,-0.661)
OSC-SMD_4P-L3.2-W2.5-BL_SIT8008BI
  rect 1.4x1.2 smd: 1(-1.1,-0.85) 2(1.1,-0.85) 3(1.1,0.85) 4(-1.1,0.85)
QFN-56_L7.0-W7.0-P0.40-TL-EP4.0
  rect 0.665x0.2 smd: 1(-3.408,2.6) 2(-3.408,2.2) 3(-3.408,1.8) 4(-3.408,1.4) 5(-3.408,1) 6(-3.408,0.6) 7(-3.408,0.2) 8(-3.408,-0.2) 9(-3.408,-0.6) 10(-3.408,-1) 11(-3.408,-1.4) 12(-3.408,-1.8) 13(-3.408,-2.2) 14(-3.408,-2.6) 29(3.408,-2.6) 30(3.408,-2.2) 31(3.408,-1.8) 32(3.408,-1.4) 33(3.408,-1) 34(3.408,-0.6) 35(3.408,-0.2) 36(3.408,0.2) 37(3.408,0.6) 38(3.408,1) 39(3.408,1.4) 40(3.408,1.8) 41(3.408,2.2) 42(3.408,2.6)
  rect 0.2x0.665 smd: 15(-2.6,-3.408) 16(-2.2,-3.408) 17(-1.8,-3.408) 18(-1.4,-3.408) 19(-1,-3.408) 20(-0.6,-3.408) 21(-0.2,-3.408) 22(0.2,-3.408) 23(0.6,-3.408) 24(1,-3.408) 25(1.4,-3.408) 26(1.8,-3.408) 27(2.2,-3.408) 28(2.6,-3.408) 43(2.6,3.408) 44(2.2,3.408) 45(1.8,3.408) 46(1.4,3.408) 47(1,3.408) 48(0.6,3.408) 49(0.2,3.408) 50(-0.2,3.408) 51(-0.6,3.408) 52(-1,3.408) 53(-1.4,3.408) 54(-1.8,3.408) 55(-2.2,3.408) 56(-2.6,3.408)
  rect 4x4 smd: 57(0,0)
R0402
  rect 0.566x0.54 smd: 1(-0.433,0) 2(0.433,0)
SOT-23-3_L2.9-W1.3-P1.90-LS2.3-BR
  rect 1.07x0.532 smd: 1(0.99,-0.95) 2(0.99,0.95) 3(-0.99,0)
SOT-223-4_L6.5-W3.5-P2.30-LS7.0-BR
  rect 2.47x0.98 smd: 1(2.835,-2.3) 2(2.835,0) 3(2.835,2.3)
  rect 2.47x3.6 smd: 4(-2.835,0)
SW-SMD_SK-3245S-L1-A-1
  rect 1x2 smd: 1(-2.5,0) 2(0,0) 3(2.5,0)
Test-Point-0.5mm
  rect 2x2 smd: 1(0,0)
TQFN-16_L3.0-W3.0-P0.50-BL-EP1.5
  rect 0.25x0.6 smd: 1(-0.749,-1.5) 2(-0.248,-1.5) 3(0.252,-1.5) 4(0.751,-1.5) 9(0.75,1.5) 10(0.25,1.5) 11(-0.25,1.5) 12(-0.749,1.5)
  rect 0.6x0.25 smd: 5(1.5,-0.748) 6(1.5,-0.248) 7(1.5,0.252) 8(1.5,0.752) 13(-1.5,0.752) 14(-1.5,0.252) 15(-1.5,-0.248) 16(-1.5,-0.748)
  rect 1.5x1.5 smd: 17(0,0)
USB-C-SMD_KH-TYPE-C-16P
  oval 1x2 hole 0.6x1.7: 1(-4.32,1.765) 2(4.32,1.765)
  oval 1x1.8 hole 0.6x1.4: 3(-4.32,-2.415) 4(4.32,-2.415)
  rect 0.3x1.3 smd: A1(-3.35,2.415) A4(-2.55,2.415) A5(-1.25,2.415) A6(-0.25,2.415) A7(0.25,2.415) A8(1.25,2.415) A9(2.55,2.415) A12(3.35,2.415) B1(3.05,2.415) B4(2.25,2.415) B5(1.75,2.415) B6(0.75,2.415) B7(-0.75,2.415) B8(-1.75,2.415) B9(-2.25,2.415) B12(-3.05,2.415)
WSON-8_L6.0-W5.0-P1.27-BL-EP
  oval 0.581x1.276 smd: 1(-1.905,-3.013) 2(-0.635,-3.013) 3(0.635,-3.013) 4(1.905,-3.013) 5(1.905,3.013) 6(0.635,3.013) 7(-0.635,3.013) 8(-1.905,3.013)
  rect 4.3x3.4 smd: 9(0,0)

## Nets
As in the schematic, except:
IO2_BTN: C38.2 R41.1 SW6.1 U1.7

Pads without a net: FPC4 8; U1 5 8 13 23 24 28 38 39 40 41 42 43 44 45 47 48 51 52; U3 1; U10 5 6 12 13; U11 5; USB2 A8 B8

## Via types
v1: diameter 0.61, hole 0.305, Top Layer to Bottom Layer, 2 vias

## Routing (per net, layer and track width the routed paths; a pad name or vN(x,y) marks a point on that pad's centre or on a via; arc(x,y) is an arc through that point)
VCC: length 4.5
  Top Layer w0.157: 12.34,31.66 12.87,31.66 13.15,31.94 13.15,32.87 ; 13.55,32.87 13.55,31.58 13.52,31.55 13.52,31.55 13.21,31.24 12.36,31.24 12.34,31.26
IO19: length 3.2
  Top Layer w0.124: USB2.B7 15.25,7.5 15.49,7.74 v1(16,7.74) 16.25,7.49 USB2.A7
IO20: length 3.9
  Top Layer w0.124: USB2.A6 15.75,5.71 15.88,5.59 16.63,5.59 16.75,5.71 USB2.B6 16.76,6.49 v1(16.76,7.74)
USB2_CC1: length 1.8
  Top Layer w0.157: R29.2 17.81,6.53 USB2.B5
USB2_CC2: length 1.8
  Top Layer w0.157: R28.2 14.75,8.18 USB2.A5
$1N26054: length 7.1
  Top Layer w0.2: 12.34,32.06 11.12,32.06 arc(10.35,32.38) 10.03,33.14 10.03,35.97 arc(10.04,35.99) 10.06,36 8.83,36 arc(8.82,36) R1.2
$1N26055: length 5.1
  Top Layer w0.2: R1.1 6.74,35.99 arc(6.73,35.99) 6.73,36 arc(6.2,36.11) 5.75,36.41 4.05,38.11 arc(3.95,38.26) U3.2
$1N28918: length 1.8
  Top Layer w0.157: R44.1 12.92,14.17 12.92,15.87

## Text on the board
Bottom Silkscreen Layer: 1

# Board PCB2
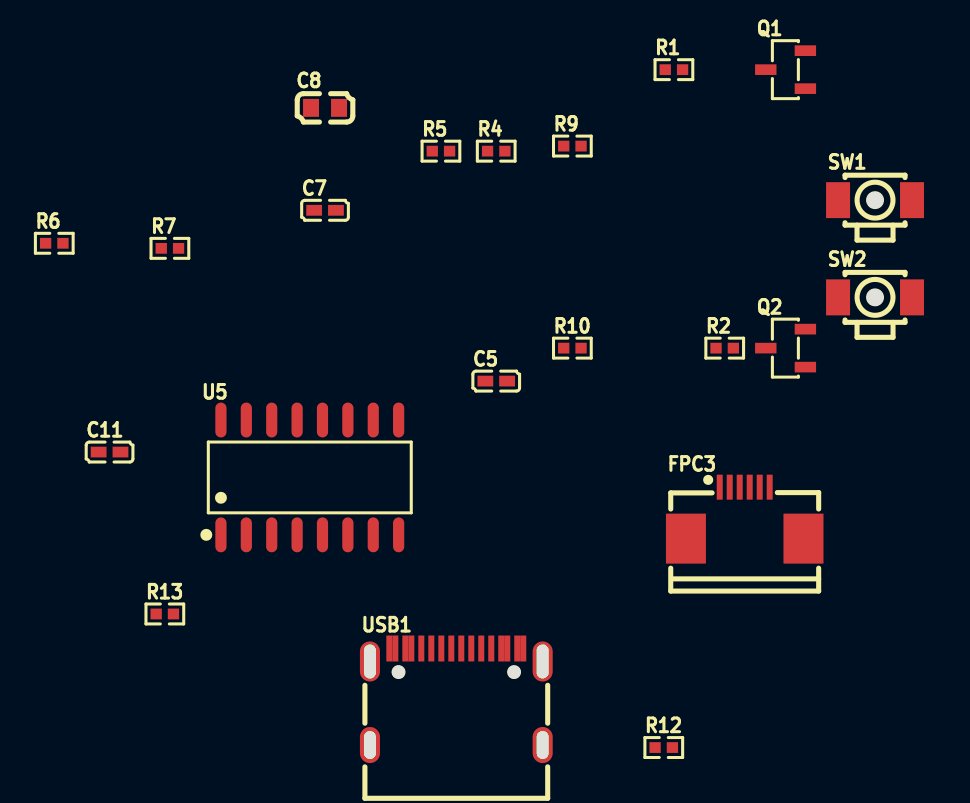
[diagram p4: board, top side]
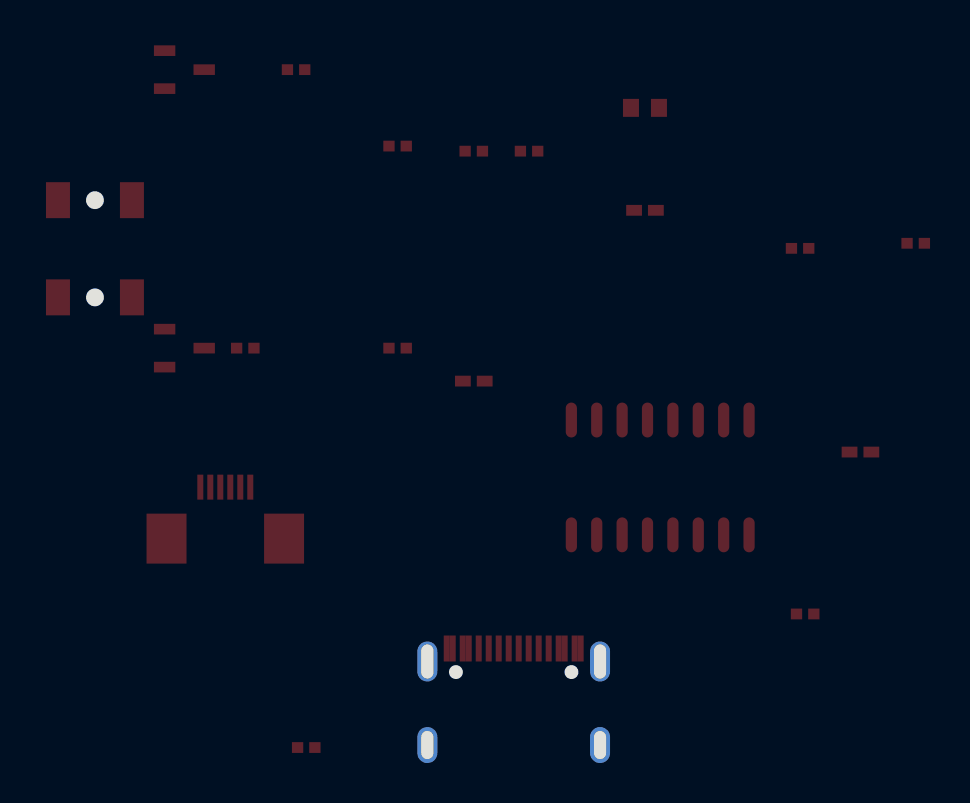
[diagram p5: board, bottom side, seen from below]

Outline 24.63 x 24.41 mm; copper layers: Top Layer, Bottom Layer. Coordinates in mm from the lower left corner of the outline.
Stack: Top Layer 0.035mm / Dielectric1 1.51mm FR4 er 4.5 / Bottom Layer 0.035mm

## Design rules (mm)
template: JLCPCB Capability(Two Layers Board)
spacing copperThickness1oz (default): track to track 0.102, other pairs 0.152 to 0.3
spacing copperThickness2oz: track to track 0.203, other pairs 0.152 to 0.3
track width copperThickness1oz (default): min 0.127, default 0.254, max 2.54
track width copperThickness2oz: min 0.203, default 0.254, max 2.54
differential pair differentialPair (default): width min 0.127, default 0.254, max 2.54; gap min 0.152, default 0.152
via viaSize (default): diameter min 0.5, default 0.61, max 10; hole min 0.3, default 0.305, max 6.3

## Placement (name value [footprint] x y rotation side)
C5  100nF  [C0402]  5.23 14.91 0 top
C7  100nF  [C0402]  -3.33 23.45 0 top
C8  10uF  [C0603]  -3.33 28.58 0 top
C11  100nF  [C0402]  -14.11 11.36 0 top
FPC3  FPC-05F-6PH20  [FPC-SMD_6P-P0.50_XUNPU_FPC-05F-6PH20]  17.66 8.31 0 top
Q1  S8050  [SOT-23-3_L2.9-W1.3-P1.90-LS2.3-BR]  19.71 30.49 0 top
Q2  S8050  [SOT-23-3_L2.9-W1.3-P1.90-LS2.3-BR]  19.71 16.56 0 top
R1  12K  [R0402]  14.12 30.49 0 top
R2  12K  [R0402]  16.66 16.56 0 top
R4  12K  [R0402]  5.23 26.41 0 top
R5  5K  [R0402]  2.47 26.41 0 top
R6  470Ω  [R0402]  -16.87 21.8 0 top
R7  470Ω  [R0402]  -11.09 21.55 0 top
R9  12K  [R0402]  9.04 26.67 0 top
R10  0  [R0402]  9.04 16.56 0 top
R12  5.1K  [R0402]  13.62 -3.43 0 top
R13  5.1K  [R0402]  -11.34 3.25 0 top
SW1  TS-1063S-B3D4  [KEY-SMD_L3.0-W2.5-LS4.0_TS-1603S]  24.19 23.96 0 top
SW2  TS-1063S-B3D4  [KEY-SMD_L3.0-W2.5-LS4.0_TS-1603S]  24.19 19.1 0 top
U5  CH340C  [SOP-16_L10.0-W3.9-P1.27-LS6.0-BL]  -4.09 10.09 0 top
USB1  KH-TYPE-C-16P  [USB-C-SMD_KH-TYPE-C-16P]  3.24 -0.89 0 top

## Footprints (pads in the part's own frame, mm; a bottom-side part is the same pattern mirrored in y, then rotated)
C0402
  rect 0.79x0.54 smd: 1(-0.545,0) 2(0.545,0)
C0603
  rect 0.8x0.9 smd: 1(-0.7,0) 2(0.7,0)
FPC-SMD_6P-P0.50_XUNPU_FPC-05F-6PH20
  rect 0.3x1.25 smd: 1(-1.25,1.288) 2(-0.75,1.288) 3(-0.25,1.288) 4(0.25,1.288) 5(0.75,1.288) 6(1.25,1.288)
  rect 2x2.5 smd: 7(2.94,-1.288) 8(-2.94,-1.288)
KEY-SMD_L3.0-W2.5-LS4.0_TS-1603S
  rect 1.2x1.8 smd: 1(-1.85,0) 2(1.85,0)
R0402
  rect 0.566x0.54 smd: 1(-0.433,0) 2(0.433,0)
SOP-16_L10.0-W3.9-P1.27-LS6.0-BL
  oval 0.56x1.745 smd: 1(-4.445,-2.873) 2(-3.175,-2.873) 3(-1.905,-2.873) 4(-0.635,-2.873) 5(0.635,-2.873) 6(1.905,-2.873) 7(3.175,-2.873) 8(4.445,-2.873) 9(4.445,2.873) 10(3.175,2.873) 11(1.905,2.873) 12(0.635,2.873) 13(-0.635,2.873) 14(-1.905,2.873) 15(-3.175,2.873) 16(-4.445,2.873)
SOT-23-3_L2.9-W1.3-P1.90-LS2.3-BR
  rect 1.07x0.532 smd: 1(0.99,-0.95) 2(0.99,0.95) 3(-0.99,0)
USB-C-SMD_KH-TYPE-C-16P
  oval 1x2 hole 0.6x1.7: 1(-4.32,1.765) 2(4.32,1.765)
  oval 1x1.8 hole 0.6x1.4: 3(-4.32,-2.415) 4(4.32,-2.415)
  rect 0.3x1.3 smd: A1(-3.35,2.415) A4(-2.55,2.415) A5(-1.25,2.415) A6(-0.25,2.415) A7(0.25,2.415) A8(1.25,2.415) A9(2.55,2.415) A12(3.35,2.415) B1(3.05,2.415) B4(2.25,2.415) B5(1.75,2.415) B6(0.75,2.415) B7(-0.75,2.415) B8(-1.75,2.415) B9(-2.25,2.415) B12(-3.05,2.415)

## Nets
As in the schematic.

Pads without a net: U5 7 8 9 10 11 12 15; USB1 A8 B8
